# EAGLE design TMotor_Rev2 (EAGLE 9.6.2)

## Sheet 1 of 3: Arduino Nano Sense
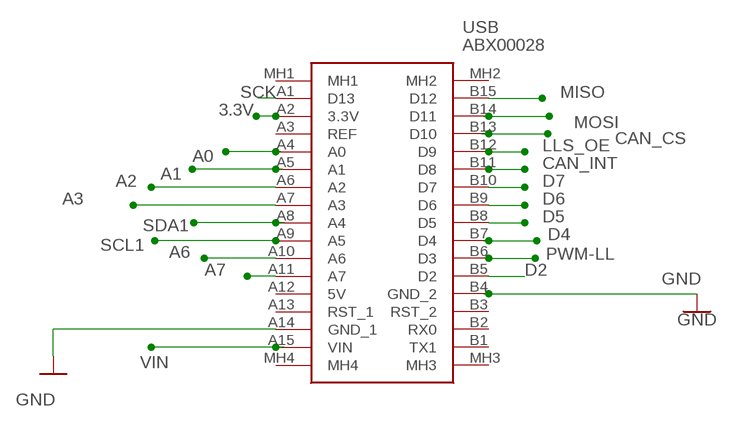
[diagram p0: schematic, sheet 1]

### Parts
USB  ABX00028  [ABX00028]

### Nets
3.3V: USB.A2(3.3V) ; also sheet 2
A0: USB.A4(A0) ; also sheet 2
A1: USB.A5(A1)
A2: USB.A6(A2) ; also sheet 2,3
A3: USB.A7(A3) ; also sheet 2,3
A6: USB.A10(A6) ; also sheet 2
A7: USB.A11(A7)
CAN_CS: USB.B13(D10) ; also sheet 2
CAN_INT: USB.B11(D8) ; also sheet 2
D2: USB.B5(D2) ; also sheet 2
D4: USB.B7(D4)
D5: USB.B8(D5)
D6: USB.B9(D6)
D7: USB.B10(D7)
GND: USB.A14(GND_1) USB.B4(GND_2) ; also sheet 2,3
LLS_OE: USB.B12(D9)
MISO: USB.B15(D12) ; also sheet 2
MOSI: USB.B14(D11) ; also sheet 2
PWM-LL: USB.B6(D3)
SCK: USB.A1(D13) ; also sheet 2
SCL1: USB.A9(A5)
SDA1: USB.A8(A4)
VIN: USB.A15(VIN) ; also sheet 2
Unconnected: USB.A3(REF) USB.A12(5V) USB.A13(RST_1) USB.B1(TX1) USB.B2(RX0) USB.B3(RST_2) USB.MH1 USB.MH2 USB.MH3 USB.MH4

## Sheet 2 of 3: Motor Drivers & Power
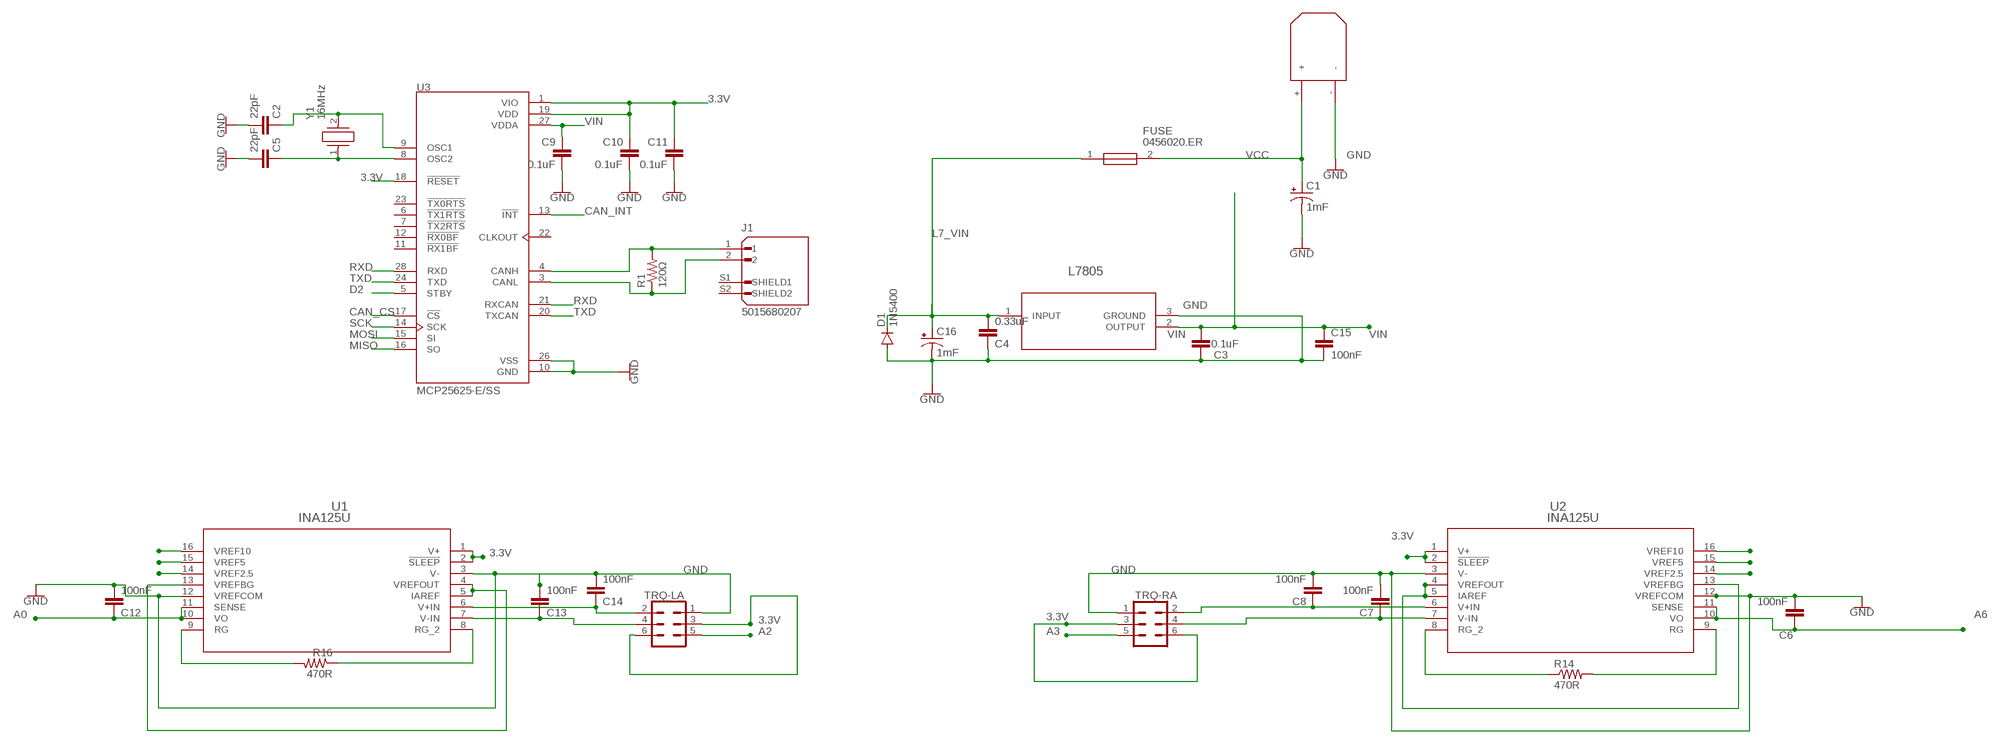
[diagram p1: schematic, sheet 2]

### Parts
C1  1mF  CPOL-USE5-10.5  [E5-10,5]
C2  22pF  C-EU050-024X044  [C050-024X044]
C3  0.1uF  C-EU050-024X044  [C050-024X044]
C4  0.33uF  C-EU050-024X044  [C050-024X044]
C5  22pF  C-EU050-024X044  [C050-024X044]
C6  100nF  C-EU050-024X044  [C050-024X044]
C7  100nF  C-EU050-024X044  [C050-024X044]
C8  100nF  C-EU050-024X044  [C050-024X044]
C9  0.1uF  C-EU050-024X044  [C050-024X044]
C10  0.1uF  C-EU050-024X044  [C050-024X044]
C11  0.1uF  C-EU050-024X044  [C050-024X044]
C12  100nF  C-EU050-024X044  [C050-024X044]
C13  100nF  C-EU050-024X044  [C050-024X044]
C14  100nF  C-EU050-024X044  [C050-024X044]
C15  100nF  C-EU050-024X044  [C050-024X044]
C16  1mF  CPOL-USE5-10.5  [E5-10,5]
D1  1N5400  [DO201-15]
FUSE  0456020.ER  [FUSC10131X312N]
J1  5015680207  [MOLEX_5015680207]
L7805  L7805CDT-TR  [DPAK_STM]
R1  120Ω  R-US_0207/10  [0207/10]
R14  470R  R-US_0207/10  [0207/10]
R16  470R  R-US_0207/10  [0207/10]
TRQ-LA  CONN_03X2SHROUD  [2X3-SHROUDED]
TRQ-RA  CONN_03X2SHROUD  [2X3-SHROUDED]
U1  INA125U  [D16]
U2  INA125U  [D16]
U3  MCP25625-E/SS  [SOP65P780X200-28N]
U$9  XT30  [XT30_HORIZONTAL]
Y1  16MHz  4.91520MHZ_HC49_4H_30_50_-40+8  [IQD-HC-49-4H]

### Nets
3.3V: C10.1 C11.1 TRQ-LA.3 TRQ-LA.6 TRQ-RA.3 TRQ-RA.6 U1.1(V+) U1.2(!SLEEP) U2.1(V+) U2.2(!SLEEP) U3.1(VIO) U3.18(!RESET) U3.19(VDD) ; also sheet 1
A0: C12.1 U1.10(VO) U1.11(SENSE) ; also sheet 1
A2: TRQ-LA.5 ; also sheet 1,3
A3: TRQ-RA.5 ; also sheet 1,3
A6: C6.1 U2.10(VO) U2.11(SENSE) ; also sheet 1
CAN_CS: U3.17(!CS) ; also sheet 1
CAN_INT: U3.13(!INT) ; also sheet 1
CANH-: J1.1 R1.2 U3.4(CANH)
CANL-: J1.2 R1.1 U3.3(CANL)
D2: U3.5(STBY) ; also sheet 1
GND: C1.- C2.2 C3.1 C4.1 C5.2 C6.2 C7.2 C8.2 C9.2 C10.2 C11.2 C12.2 C13.2 C14.2 C15.2 C16.- D1.A L7805.3(GROUND) TRQ-LA.1 TRQ-RA.1 U1.3(V-) U1.12(VREFCOM) U2.3(V-) U2.12(VREFCOM) U3.10(GND) U3.26(VSS) U$9.- ; also sheet 1,3
L7_VIN: C4.2 C16.+ D1.C FUSE.1 L7805.1(INPUT)
MISO: U3.16(SO) ; also sheet 1
MOSI: U3.15(SI) ; also sheet 1
N$1: C2.1 U3.9(OSC1) Y1.2
N$2: C5.1 U3.8(OSC2) Y1.1
N$3: U1.4(VREFOUT) U1.5(IAREF) U1.13(VREFBG)
N$4: U2.16(VREF10)
N$5: U2.4(VREFOUT) U2.5(IAREF) U2.13(VREFBG)
N$6: R14.1 U2.8(RG_2)
N$7: R14.2 U2.9(RG)
N$8: C8.1 TRQ-RA.2 U2.6(V+IN)
N$9: C7.1 TRQ-RA.4 U2.7(V-IN)
N$10: C14.1 TRQ-LA.2 U1.6(V+IN)
N$11: C13.1 TRQ-LA.4 U1.7(V-IN)
N$12: R16.2 U1.9(RG)
N$13: R16.1 U1.8(RG_2)
N$14: U2.15(VREF5)
N$19: U2.14(VREF2.5)
N$20: U1.16(VREF10)
N$21: U1.15(VREF5)
N$22: U1.14(VREF2.5)
RXD: U3.21(RXCAN) U3.28(RXD)
SCK: U3.14(SCK) ; also sheet 1
TXD: U3.20(TXCAN) U3.24(TXD)
VCC: C1.+ FUSE.2 U$9.+
VIN: C3.2 C9.1 C15.1 L7805.2(OUTPUT) U3.27(VDDA) ; also sheet 1
Unconnected: J1.S1(SHIELD1) J1.S2(SHIELD2) U3.6(!TX1RTS) U3.7(!TX2RTS) U3.11(!RX1BF) U3.12(!RX0BF) U3.22(CLKOUT) U3.23(!TX0RTS)

## Sheet 3 of 3: FSRs, Hall, and Breakout
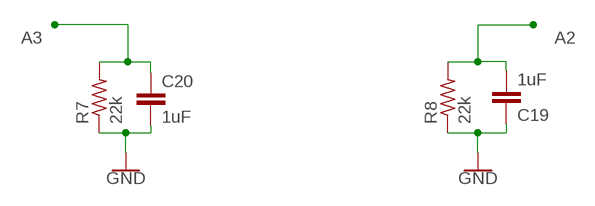
[diagram p2: schematic, sheet 3]

### Parts
C19  1uF  C-EU050-024X044  [C050-024X044]
C20  1uF  C-EU050-024X044  [C050-024X044]
R7  22k  R-US_0207/10  [0207/10]
R8  22k  R-US_0207/10  [0207/10]

### Nets
A2: C19.2 R8.2 ; also sheet 1,2
A3: C20.1 R7.2 ; also sheet 1,2
GND: C19.1 C20.2 R7.1 R8.1 ; also sheet 1,2

## Library data of the parts
C1 C16 = rcl:CPOL-US: POLARIZED CAPACITOR, American symbol; SPICEPREFIX: C
C2-C15 C19 C20 = rcl:C-EU: CAPACITOR, European symbol; SPICEPREFIX: C
D1 = diode:1N5400: DIODE standard rectifier, 3 A, 50 V (Motorola)
FUSE = SamacSys_Parts:0456020.ER: Littelfuse 20A FF Non-Resettable Surface Mount Fuse, 125V ac Source: Datasheet <https://componentsearchengine.com/Datasheets/1/0456020.ER.pdf>; DESCRIPTION: Littelfuse 20A FF Non-Resettable Surface Mount Fuse, 125V ac; HEIGHT: 3.12mm; MANUFACTURER_NAME: LITTELFUSE; MANUFACTURER_PART_NUMBER: 0456020.ER; MOUSER_PART_NUMBER: 576-0456020.ER; MOUSER_PRICE-STOCK: https://www.mouser.com/Search/Refine.aspx?Keyword=576-0456020.ER
J1 = SnapEDA-Library_Paul:5015680207; MANUFACTURER: Molex; MAXIMUM_PACKAGE_HEIGHT: 3.2 mm; PARTREV: A; STANDARD: Manufacturer Recommendations
L7805 = 7805Regulator:L7805CDT-TR; BUILT_BY: EMA_UL_Team; MANUFACTURER_PART_NUMBER: L7805CDT-TR; SOURCELIBRARY: StMicro_2011-06-07; VENDOR: STMicroelectronics
R1 R14 R16 = rcl:R-US_: RESISTOR, American symbol; SPICEPREFIX: R
R7 R8 = resistor:R-US_: RESISTOR, American symbol
TRQ-LA TRQ-RA = SparkFun-Connectors:CONN_03X2: Multi connection point. Often used as Generic Header-pin footprint for 0.1 inch spaced/style header connections You can populate with any combo of single row headers, but if you'd like an exact match, check these: Header - 2x3 (Male, 0.1") <https://www.sparkfun.com/products/12807> (PRT-12807) Header - 2x3 (Female, 0.1") <https://www.sparkfun.com/products/13010> (PRT-13010) 2x3 Pin Shrouded Header <https://www.sparkfun.com/products/10877> (PRT-10877) On any of the 0.1 inch spaced packages, you can populate with these: Break Away Headers - Straight <https://www.sparkfun.com/products/116> (PRT-00116) Break Away Male Headers - Right Angle <https://www.sparkfun.com/products/553> (PRT-00553) Female Headers <https://www.sparkfun.com/products/115> (PRT-00115) Break Away Headers - Machine Pin <https://www.sparkfun.com/products/117> (PRT-00117) Break Away Female Headers - Swiss Machine Pin <https://www.sparkfun.com/products/743> (PRT-00743) Special note: the shrouded connector mates well with our 3x2 ribbon cables: Ribbon Crimp Connector - 6-pin (2x3, Female) <https://www.sparkfun.com/products/10651> (PRT-10651) Ribbon Cable - 6 wire (15ft) <https://www.sparkfun.com/products/10646> (PRT-10646); PROD_ID: CONN-10681; SF_ID: PRT_10877
U1 U2 = Digikey:INA125U; DATASHEET_URL: http://www.ti.com/lit/gpn/INA125; DESCRIPTION: Instrumentation Amplifier with Precision Voltage Reference; FAMILY_NAME: SINGLE SUPPLY; GENERIC_PART_NUMBER: INA125; INDUSTRY_STD_PKG_TYPE: SOIC; MANUFACTURER: Texas Instruments; MANUFACTURER_PART_NUMBER: INA125U; PACKAGE_DESIGNATOR: D; PIN_COUNT: 16; VENDOR: Texas Instruments
U3 = MCP25625-E_SS:MCP25625-E/SS: 28 SSOP .209in TUBECAN Controller with Integrated Transceiver Check availability <https://pricing.snapeda.com/parts/MCP25625-E/SS/Microchip%20Technology/view-part?ref=eda>; AVAILABILITY: In Stock; DESCRIPTION: 1/1 Transceiver - CANbus 28-SSOP; MF: Microchip Technology; MP: MCP25625-E/SS; PACKAGE: SSOP-28 Microchip; PRICE: None; PURCHASE-URL: https://pricing.snapeda.com/search/part/MCP25625-E/SS/?ref=eda
U$9 = Ben_Library:XT30
USB = ABX00028:ABX00028: Development Boards & Kits - AVR Arduino Nano Every Source: Datasheet <https://store.arduino.cc/arduino-nano-every>; ARROW_PART_NUMBER: ABX00028; ARROW_PRICE-STOCK: https://www.arrow.com/en/products/abx00028/arduino-corporation; DESCRIPTION: Development Boards & Kits - AVR Arduino Nano Every; HEIGHT: 10mm; MANUFACTURER_NAME: Arduino; MANUFACTURER_PART_NUMBER: ABX00028; MOUSER_PART_NUMBER: 782-ABX00028; MOUSER_PRICE-STOCK: https://www.mouser.co.uk/ProductDetail/Arduino/ABX00028/?qs=PzGy0jfpSMtit6rnFl8mVg%3D%3D
Y1 = SnapEDA-Library_Paul:4.91520MHZ_HC49_4H_30_50_-40+8: IQD 4.9152MHz Crystal +/-30ppm HC-49 2-Pin Source: Datasheet <http://uk.rs-online.com/web/p/products/8141828>; DESCRIPTION: IQD 4.9152MHz Crystal +/-30ppm HC-49 2-Pin; HEIGHT: mm; MANUFACTURER_NAME: IQD; MANUFACTURER_PART_NUMBER: 4.91520MHz HC49/4H 30/50/-40+85C/30pF

## Board
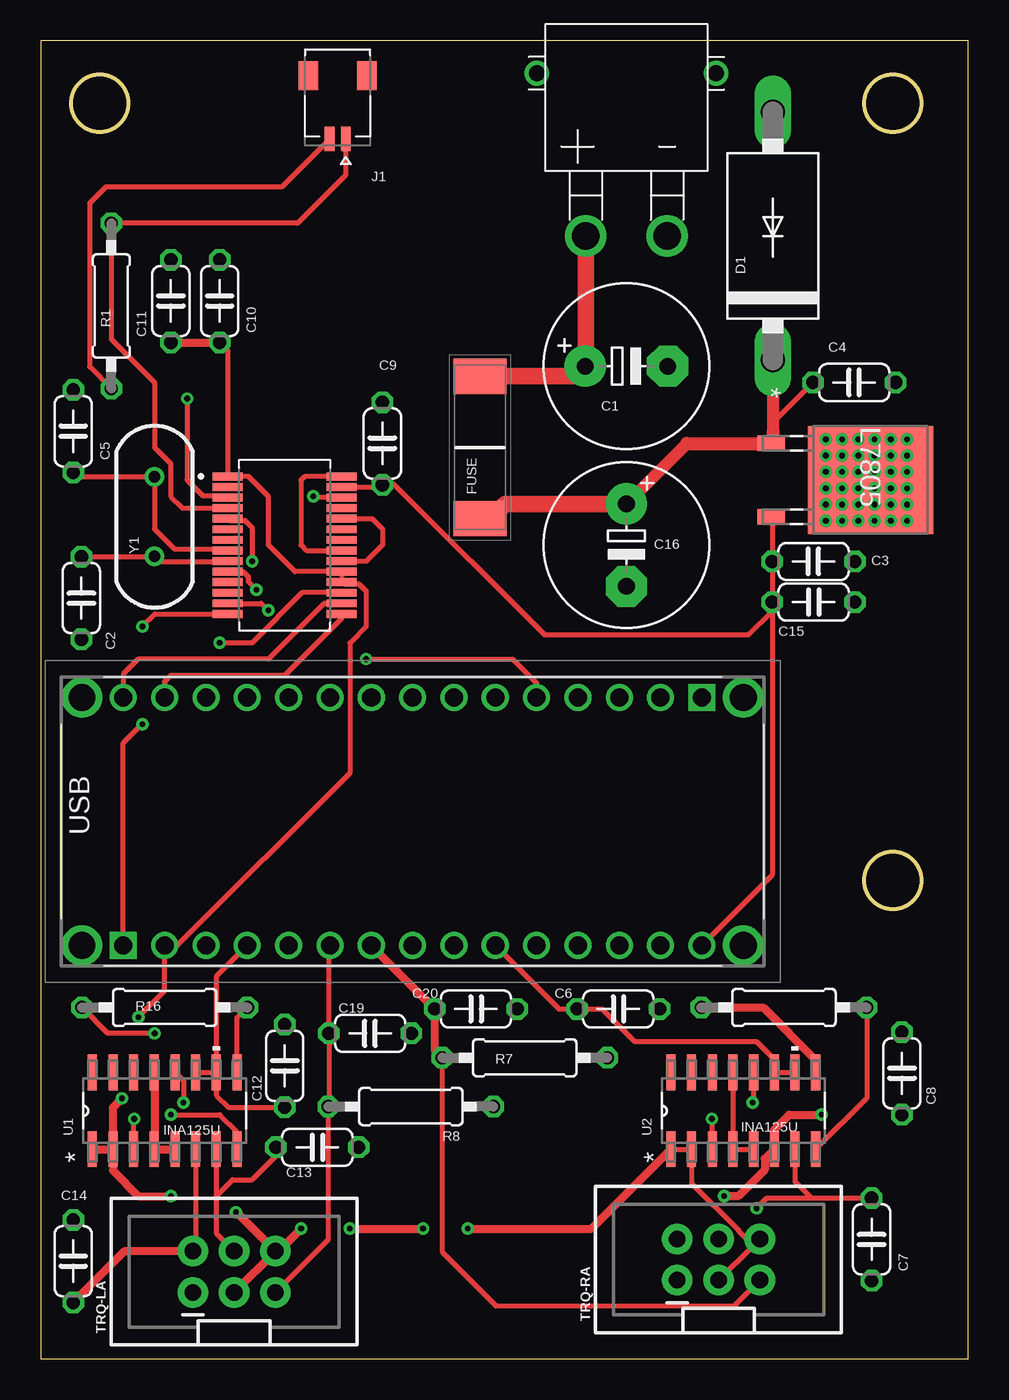
[diagram p3: board, top side]
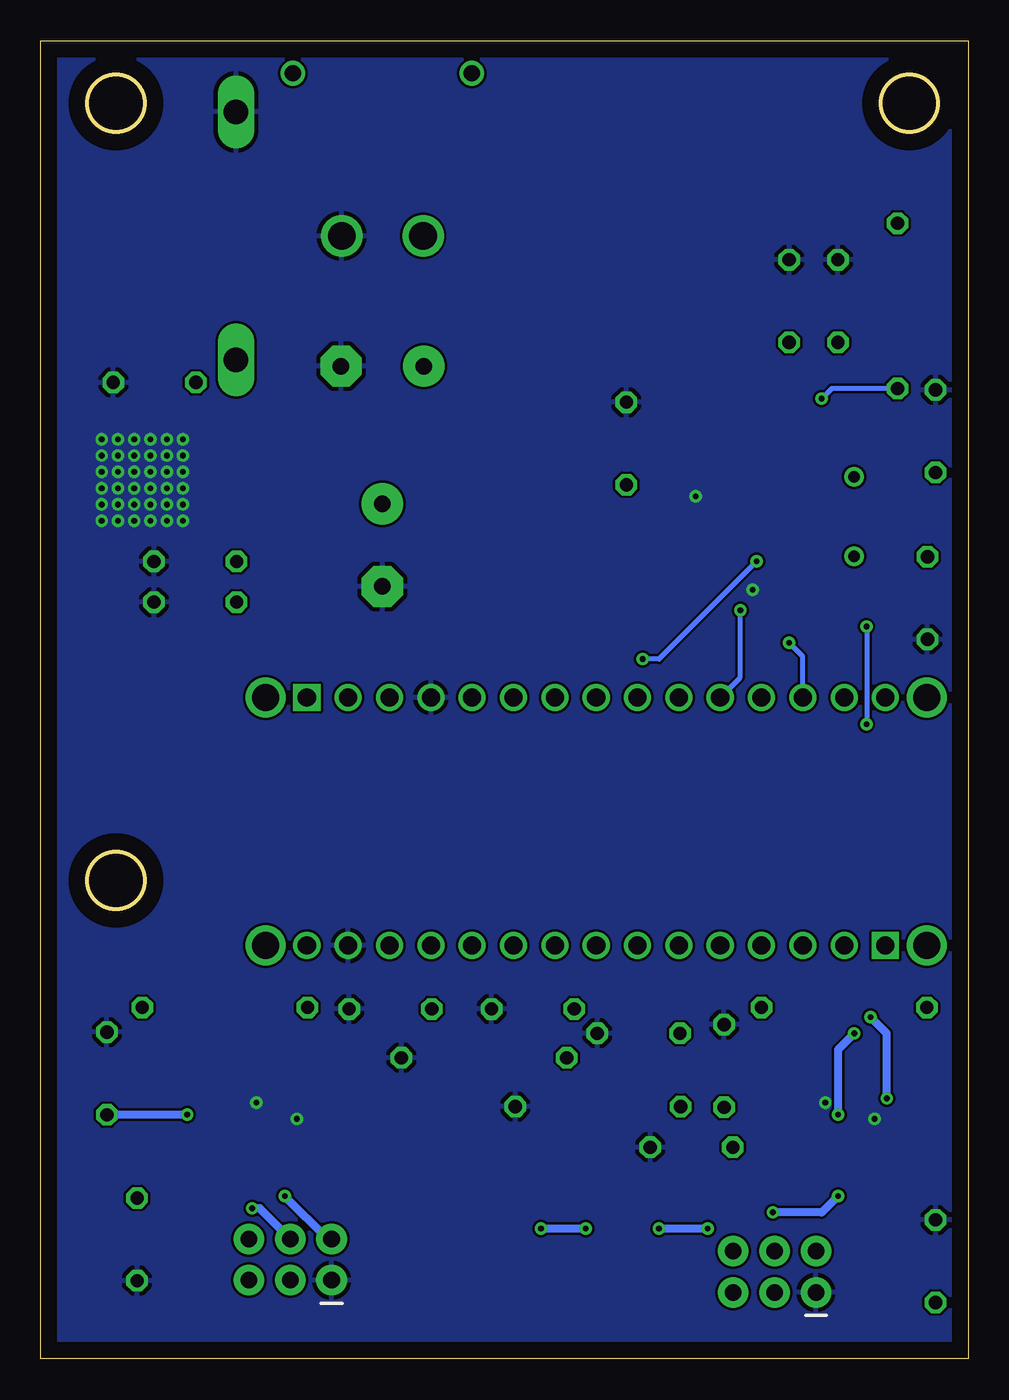
[diagram p4: board, bottom side, seen from below]

Size 57 x 81 mm. Coordinates in mm from the lower left corner, seen from the top.
Outline: 0,0 57,0 57,81 0,81 0,0
Outline: circle at 3.62,77.15 radius 1.75
Outline: circle at 52.37,77.15 radius 1.75
Outline: circle at 52.37,29.4 radius 1.75
Copper layers (1*16): Top 0.035mm / dielectric 1.5mm / Bottom 0.035mm
Design rules "default": minimum track width 6mil, minimum drill 0.35mm, track to track 6mil, track to pad 6mil, pad to pad 6mil, via to via 6mil, smd to smd 6mil, copper to edge 40mil, drill to drill 6mil, minimum pad ring 10mil, minimum via ring 8mil, stop-mask expansion 4mil, vias tented up to drill 0mil, thermal gap 10mil

### Footprints (pad centres in the part's own frame; a part is rotated, then mirrored left to right if it is on the bottom)
E5-10,5 = drill 1.016 pad 2.54: + -2.54,0 | drill 1.016 pad 2.54 octagon: - 2.54,0
C050-024X044 = drill 0.813 octagon: 1 -2.54,0; 2 2.54,0
DO201-15 = drill 1.499 long: A 7.62,0; C -7.62,0
FUSC10131X312N = smd 2.16 x 3.23: 1 -4.375,0; 2 4.375,0
MOLEX_5015680207 = smd 0.6 x 1.5: 1 -0.5,2.55; 2 0.5,2.55 | smd 1.2 x 1.8: S1 1.8,-1.35; S2 -1.8,-1.35
DPAK_STM = smd 0.94 x 1.702: 1 -2.25,-6.109; 2 2.25,-6.109 | smd 6.655 x 7.722: 3 0,0
0207/10 = drill 0.813 octagon: 1 -5.08,0; 2 5.08,0
2X3-SHROUDED = drill 1.016 pad 1.88: 1 -1.27,2.54; 2 1.27,2.54; 3 -1.27,0; 4 1.27,0; 5 -1.27,-2.54; 6 1.27,-2.54
D16 = smd 2.184 x 0.559: 1 -2.362,4.445; 2 -2.362,3.175; 3 -2.362,1.905; 4 -2.362,0.635; 5 -2.362,-0.635; 6 -2.362,-1.905; 7 -2.362,-3.175; 8 -2.362,-4.445; 9 2.362,-4.445; 10 2.362,-3.175; 11 2.362,-1.905; 12 2.362,-0.635; 13 2.362,0.635; 14 2.362,1.905; 15 2.362,3.175; 16 2.362,4.445
SOP65P780X200-28N = smd 1.9 x 0.48: 1 -3.505,4.225; 2 -3.505,3.575; 3 -3.505,2.925; 4 -3.505,2.275; 5 -3.505,1.625; 6 -3.505,0.975; 7 -3.505,0.325; 8 -3.505,-0.325; 9 -3.505,-0.975; 10 -3.505,-1.625; 11 -3.505,-2.275; 12 -3.505,-2.925; 13 -3.505,-3.575; 14 -3.505,-4.225; 15 3.505,-4.225; 16 3.505,-3.575; 17 3.505,-2.925; 18 3.505,-2.275; 19 3.505,-1.625; 20 3.505,-0.975; 21 3.505,-0.325; 22 3.505,0.325; 23 3.505,0.975; 24 3.505,1.625; 25 3.505,2.275; 26 3.505,2.925; 27 3.505,3.575; 28 3.505,4.225
XT30_HORIZONTAL = drill 1.7: + -2.5,0; - 2.5,0 | drill 1: P$3 5.5,10; P$4 -5.5,10
ABX00028 = drill 1.11 pad 1.665 square: A1 0,0; B1 35.56,15.24 | drill 1.11 pad 1.665: A2 2.54,0; A3 5.08,0; A4 7.62,0; A5 10.16,0; A6 12.7,0; A7 15.24,0; A8 17.78,0; A9 20.32,0; A10 22.86,0; A11 25.4,0; A12 27.94,0; A13 30.48,0; A14 33.02,0; A15 35.56,0; B2 33.02,15.24; B3 30.48,15.24; B4 27.94,15.24; B5 25.4,15.24; B6 22.86,15.24; B7 20.32,15.24; B8 17.78,15.24; B9 15.24,15.24; B10 12.7,15.24; B11 10.16,15.24; B12 7.62,15.24; B13 5.08,15.24; B14 2.54,15.24; B15 0,15.24 | drill 1.65 pad 2.475: MH1 -2.54,0; MH2 -2.54,15.24; MH3 38.1,15.24; MH4 38.1,0
IQD-HC-49-4H = drill 0.7 pad 1.2: 1 -2.44,0; 2 2.44,0

### Placement (x,y rotation side)
C1  36,61 0 top
C2  2.5,46.75 270 top
C3  47.5,49 180 top
C4  50,60 180 top
C5  2,57 90 top
C6  35.5,21.5 0 top
C7  51.07,7.34 270 top
C8  52.93,17.54 90 top
C9  21,56.25 90 top
C10  11,65 90 top
C11  8,65 90 top
C12  15,18 90 top
C13  17,13 0 top
C14  2,6 90 top
C15  47.5,46.5 0 top
C16  36,50 270 top
C19  20.25,20 180 top
C20  26.75,21.5 0 top
D1  45,69 90 top
FUSE  27,56 90 top
J1  18.25,77.5 180 top
L7805  51,54 270 top
R1  4.34,64.7 90 top
R7  29.75,18.5 180 top
R8  22.75,15.5 180 top
R14  45.68,21.59 180 top
R16  7.62,21.59 0 top
TRQ-LA  11.89,5.35 90 top
TRQ-RA  41.66,6.1 90 top
U1  7.62,15.24 90 top
U2  43.18,15.24 90 top
U3  15,50 0 top
U$9  36,69 0 top
USB  5.08,25.4 0 top
Y1  7,51.75 270 top

### Tracks (layer width: path | path; a pad name or v marks a point on that pad's centre or on a via)
3.3V  (via drill 0.35)
  Top 0.3: v6,21 7.62,22.62 USB.A2 | TRQ-RA.6 43.79,6.96 | 43.79,6.96 TRQ-RA.3 | 43.79,6.96 42.9,7.85 42.9,7.88 40.01,10.78 U2.2 | C10.1 11.49,61.97 U3.1 12.78,54.23 14,53 14,50 15.62,48.38 U3.19 U3.18 18.61,47.62 19.56,47.62 20,47.18 20,45 19,44
  Top 0.305: USB.A2 8.4,25.4 19,36 19,44 | U2.1 U2.2
  Top 0.5: TRQ-LA.6 TRQ-LA.3 | U1.1 U1.2 | U1.2 4.45,15.45 v5,16 | U1.2 4.45,11.55 6,10 v8,10 | v12,9 12.05,9 TRQ-LA.6 | U2.1 33.86,8 v26.25,8 | TRQ-LA.6 14.62,6.62 v16,8 | C11.1 C10.1 | v19,8 v23.5,8
  Bottom 0.5: v8,10 9,9 v12,9 | v16,8 v19,8 | v6,21 5,20 v5,16 | v23.5,8 v26.25,8
A0
  Top 0.3: U1.10 10.79,23.5 USB.A4 | U1.10 10.79,16.2 11.54,15.46 C12.1 | U1.11 U1.10
A2
  Top 0.3: TRQ-LA.5 17.67,7.32 R8.2 17.71,15.54 C19.2 17.71,25.33 USB.A6
A3
  Top 0.3: R7.2 24.67,6.58 28.01,3.24 42.61,3.24 TRQ-RA.5
  Top 0.5: USB.A7 C20.1 24.21,18.96 R7.2
A6
  Top 0.3: U2.11 U2.10 | 45.09,18.41 44,19.5 36.5,19.5 34.5,21.5 C6.1 31.84,21.5 USB.A10
  Top 0.5: 45.09,18.41 U2.11
CAN_CS  (via drill 0.35)
  Top 0.3: v11,44 13,44 16.07,47.08 U3.17
  Bottom 0.3: USB.B13 10.16,43.16 v11,44
CAN_INT  (via drill 0.35)
  Top 0.3: U3.13 13.57,46.42 v14,46
  Bottom 0.3: USB.B11 14,41.88 v14,46
CANH-
  Top 0.3: J1.1 18.75,72.75 15.78,69.78 R1.2 4.34,62.66 7,60 7,56 8,55 8,53 8.72,52.27 U3.4
CANL-  (via drill 0.35)
  Top 0.3: U3.3 11.39,53.03 9.97,53.03 9,54 v9,59 | J1.2 14.8,72 4,72 3,71 3,60.96 R1.1
  Bottom 0.3: R1.1 8.38,59.62 v9,59
D2  (via drill 0.35)
  Top 0.3: U3.5 11.6,51.52 12.55,51.52 13,51.07 v13,49 | USB.B5 30.48,41.52 29,43 v20,43
  Bottom 0.3: v20,43 19,43 v13,49
GND  (via drill 0.35)
  Top 0.305: v13.25,47.25 12.75,47.75 12.75,48.07 12.45,48.38 U3.10 | U3.26 16.82,52.92 v16.75,53 | U2.12 43.81,15.81 v43.75,15.75 | U2.3 41.27,14.72 v41.25,14.75 | U1.3 5.71,14.71 v5.75,14.75 | U1.12 8.78,17.08 v8.78,15.75 | L7805.3 51,54.25 v51.25,54.5 | L7805.3 50.5,53.5 v50.25,53.5 | L7805.3 50.75,54 v50.25,54.5 | L7805.3 51,53.75 v51.25,53.5
  other vias: 48.25,51.5 48.25,56.5 49.25,56.5 50.25,56.5 51.25,56.5 52.25,56.5 53.25,56.5 48.25,55.5 49.25,55.5 50.25,55.5 51.25,55.5 52.25,55.5 53.25,55.5 48.25,54.5 49.25,54.5 52.25,54.5 53.25,54.5 48.25,53.5 49.25,53.5 52.25,53.5 53.25,53.5 48.25,52.5 49.25,52.5 50.25,52.5 51.25,52.5 52.25,52.5 53.25,52.5 49.25,51.5 50.25,51.5 51.25,51.5 52.25,51.5 53.25,51.5
  pour Bottom: -5,86 -5,-1 0,-6 56,-6 61,-1 61,0 61,82 60,83 57,86
L7_VIN
  Top 0.3: C4.2 45,57.54 45,57
  Top 0.75: C16.+ 39.71,56.25 | D1.C 45,57
  Top 0.813: 39.71,56.25 L7805.1 45,56.36 45,57
  Top 1: FUSE.1 27.62,51.62 28.54,52.54 C16.+
MISO
  Top 0.3: USB.B15 5.08,42.08 6,43 14,43 17.43,46.42 U3.16
MOSI
  Top 0.3: USB.B14 7.62,41.62 8,42 15,42 18.5,45.51 U3.15
N$1
  Top 0.3: U3.9 11.47,49 7.31,49 Y1.2 6.98,49.29 C2.1
N$2
  Top 0.3: U3.8 11.41,49.76 8.24,49.76 7,51 Y1.1 2.27,54.19 C5.1
N$3
  Top 0.5: U1.4 | U1.4 U1.5 | U1.13 7,17.59 U1.4
N$5
  Top 0.3: U2.5 U2.4 U2.13
N$6
  Top 0.3: R14.1 50.76,16.01 U2.8
N$7
  Top 0.5: U2.9 47.62,18.38 44.41,21.59 R14.2
N$8  (via drill 0.35)
  Top 0.5: v42,10 42.88,10 44.5,11.62 44.5,12.29 U2.6 45.09,14.09 46,15 v48,15
  Bottom 0.5: v42,10 39.37,7.37 TRQ-RA.2 | v48,15 C8.1
N$9  (via drill 0.35)
  Top 0.3: v44,9.25 44.63,9.88 47.37,9.88 | C7.1 47.5,9.88 47.37,9.88 | U2.7 46.35,10.89 47.37,9.88
  Bottom 0.5: TRQ-RA.4 43.54,9.25 v44,9.25
N$10
  Top 0.305: U1.6 9.53,6.79
  Top 0.5: 9.53,6.79 9.37,6.63 | 9.37,6.63 TRQ-LA.2 | C14.1 5.17,6.63 9.37,6.63
N$11
  Top 0.3: U1.7 10.79,10 | 10.79,10 10.79,7.71 TRQ-LA.4 | 10.79,10 11.79,11 13,11 14.46,12.46 C13.1
N$12
  Top 0.305: U1.9 12.06,20.95 R16.2
N$13  (via drill 0.35)
  Top 0.3: v8,15 11,15 | v7,20 4.13,20 R16.1
  Top 0.305: 11,15 12.06,13.94 U1.8
  Bottom 0.5: v7,20 8,19 v8,15
RXD
  Top 0.3: U3.28 16.23,54.23 16,54 16,50 16.32,49.67 U3.21
SCK  (via drill 0.35)
  Top 0.3: USB.A1 5.08,37.83 v6.25,39 | v6.25,45 7.03,45.77 U3.14
  Bottom 0.3: v6.25,39 6.21,39.03 6.21,44.97 v6.25,45
TXD
  Top 0.3: U3.24 20.38,51.62 21,51 21,50 20,49 18.53,49 U3.20
VCC
  Top 1: FUSE.2 32.84,60.38 C1.+ 33.5,61.04 U$9.+
VIN
  Top 0.3: 21.89,53.58 30.96,44.5 43.5,44.5
  Top 0.305: 43.5,44.5 44.96,45.96 C15.1 | C15.1 C3.2 44.96,51.68 L7805.2 | C15.1 44.96,29.72 USB.A15 | U3.27 20.86,53.58 C9.1 21.75,53.71 21.89,53.58